# EAGLE schematic Schematic (EAGLE 7.6.0)
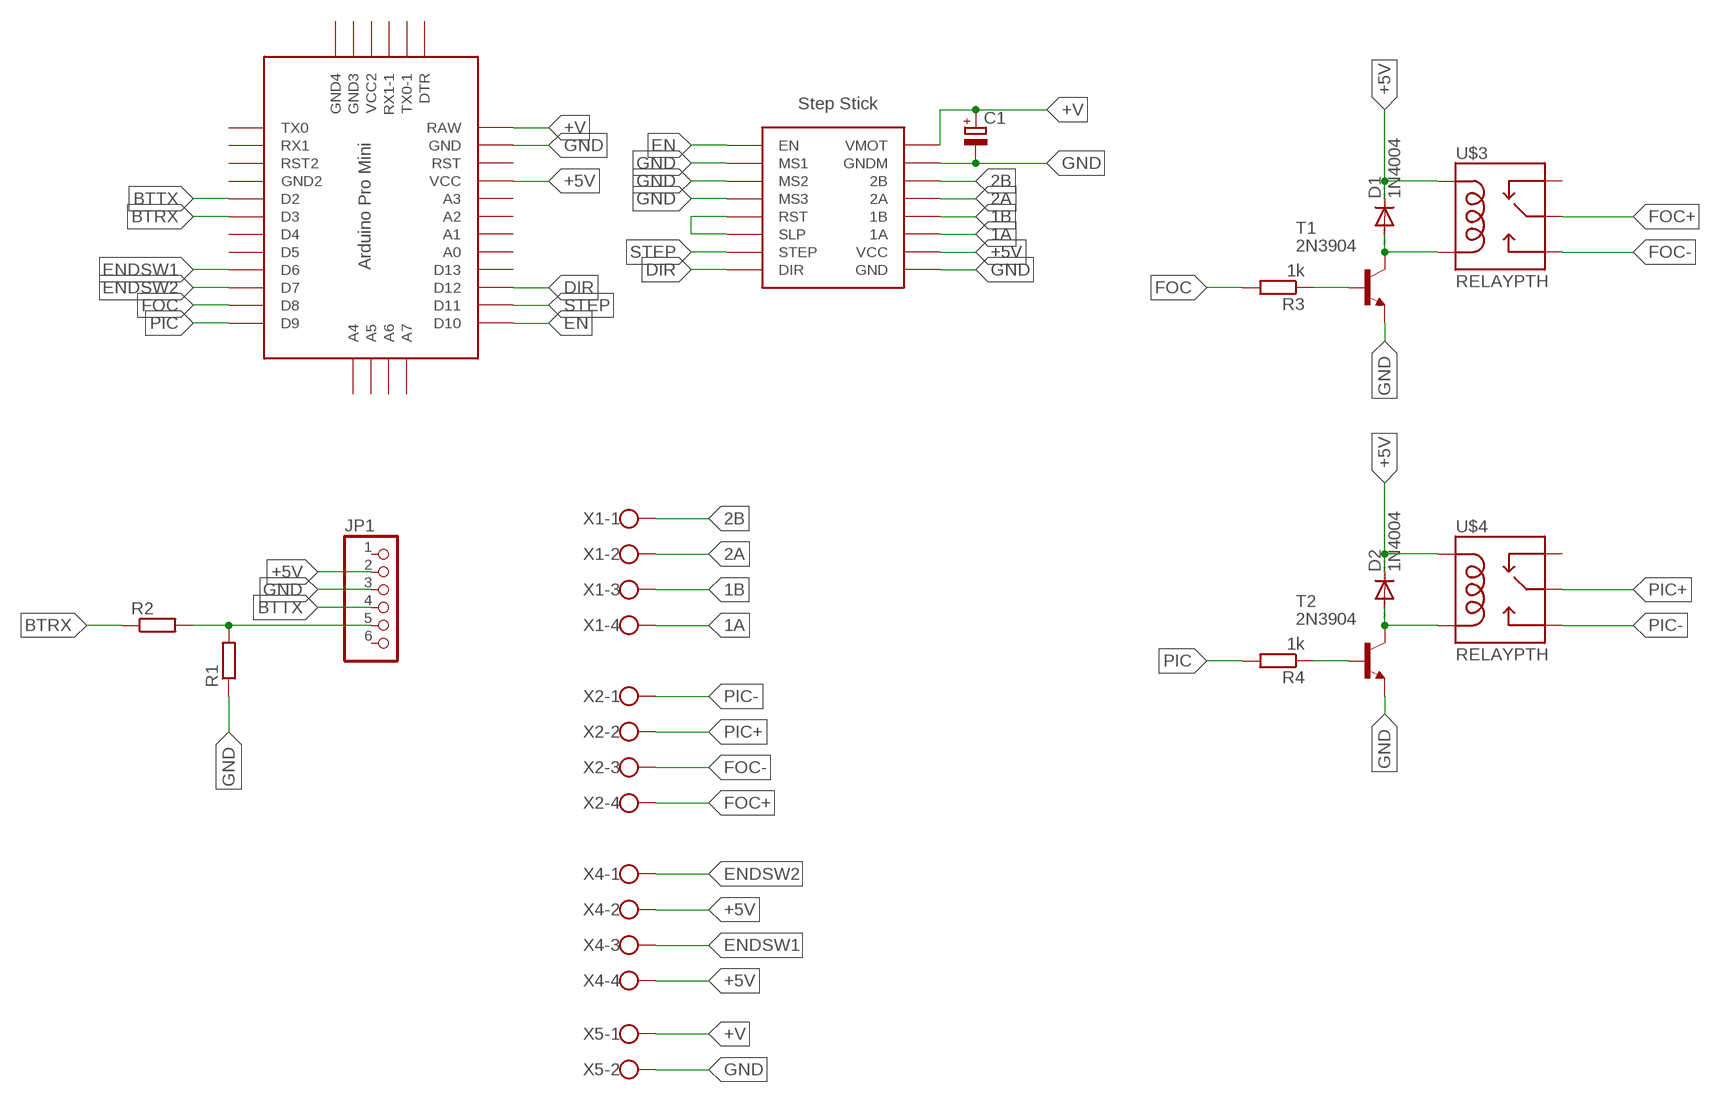
[diagram p0: schematic, sheet 1]

## Parts
C1  CPOL-EUE2,5-6E  [E2,5-6E]
D1  1N4004  [DO41-10]
D2  1N4004  [DO41-10]
JP1  PINHD-1X6  [1X06]
R1  R-EU_0207/7  [0207/7]
R2  R-EU_0207/7  [0207/7]
R3  1k  R-EU_0207/7  [0207/7]
R4  1k  R-EU_0207/7  [0207/7]
T1  2N3904  [TO92]
T2  2N3904  [TO92]
U$1  PRO-MINI  [PRO-MINI]
U$2  STEP-STICK  [STEP-STICK]
U$3  RELAYPTH  [SRD-05VDC-SL-C]
U$4  RELAYPTH  [SRD-05VDC-SL-C]
X1  W237-4  [W237-4]
X2  W237-4  [W237-4]
X4  W237-4  [W237-4]
X5  W237-102  [W237-102]

## Nets
1A: U$2.1A X1.4
1B: U$2.1B X1.3
2A: U$2.2A X1.2
2B: U$2.2B X1.1
+5V: D1.C D2.C JP1.2 U$1.VCC U$2.VCC U$3.COIL1 U$4.COIL1 X4.2 X4.4
+V: C1.+ U$1.RAW U$2.VMOT X5.1
BTRX: R2.1 U$1.D3
BTTX: JP1.4 U$1.D2
DIR: U$1.D12 U$2.DIR
EN: U$1.D10 U$2.EN
ENDSW1: U$1.D6 X4.3
ENDSW2: U$1.D7 X4.1
FOC: R3.2 U$1.D8
FOC+: U$3.SWCOMMON X2.4
FOC-: U$3.SWOPEN X2.3
GND: C1.- JP1.3 R1.1 T1.3(E) T2.3(E) U$1.GND U$2.GND U$2.GNDM U$2.MS1 U$2.MS2 U$2.MS3 X5.2
N$4: D1.A T1.1(C) U$3.COIL0
N$5: JP1.5 R1.2 R2.2
N$6: R3.1 T1.2(B)
N$7: D2.A T2.1(C) U$4.COIL0
N$9: R4.1 T2.2(B)
N$16: U$2.RST U$2.SLP
PIC: R4.2 U$1.D9
PIC+: U$4.SWCOMMON X2.2
PIC-: U$4.SWOPEN X2.1
STEP: U$1.D11 U$2.SPT(STEP)
Unconnected: JP1.1 JP1.6 U$1.A0 U$1.A1 U$1.A2 U$1.A3 U$1.A4 U$1.A5 U$1.A6 U$1.A7 U$1.D4 U$1.D5 U$1.D13 U$1.DTR U$1.GND1(GND2) U$1.GND2(GND4) U$1.GND3 U$1.RST U$1.RST1(RST2) U$1.RX1 U$1.RX1-1 U$1.TX0 U$1.TX0-1 U$1.VCC1(VCC2) U$3.SWCLOSED(SWCLOSE) U$4.SWCLOSED(SWCLOSE)

## Library data of the parts
C1 = rcl:CPOL-EU: POLARIZED CAPACITOR, European symbol
D1 D2 = diode:1N4004: DIODE general purpose rectifier, 1 A
JP1 = pinhead:PINHD-1X6: PIN HEADER
R1-R4 = resistor:R-EU_: RESISTOR, European symbol
T1 T2 = transistor:2N3904: NPN TRANSISTOR
U$1 = Arduino-clone:PRO-MINI: Arduion Pro Mini Clone V1.0 www.betemcu.cu
U$2 = Arduino-clone:STEP-STICK
U$3 U$4 = SRD-05VDC-SL-C:RELAY: SPDT relay (COM-00101)
X1 X2 X4 = con-wago-500:W237-4: WAGO SCREW CLAMP; OC_FARNELL: unknown; OC_NEWARK: unknown
X5 = con-wago-500:W237-102: WAGO SCREW CLAMP; MPN: 237-102; OC_FARNELL: unknown; OC_NEWARK: 70K9898